# EAGLE design PowerMeterCurrent (EAGLE 7.3.0)
DATABASE: ../../../../digikeydb.txt
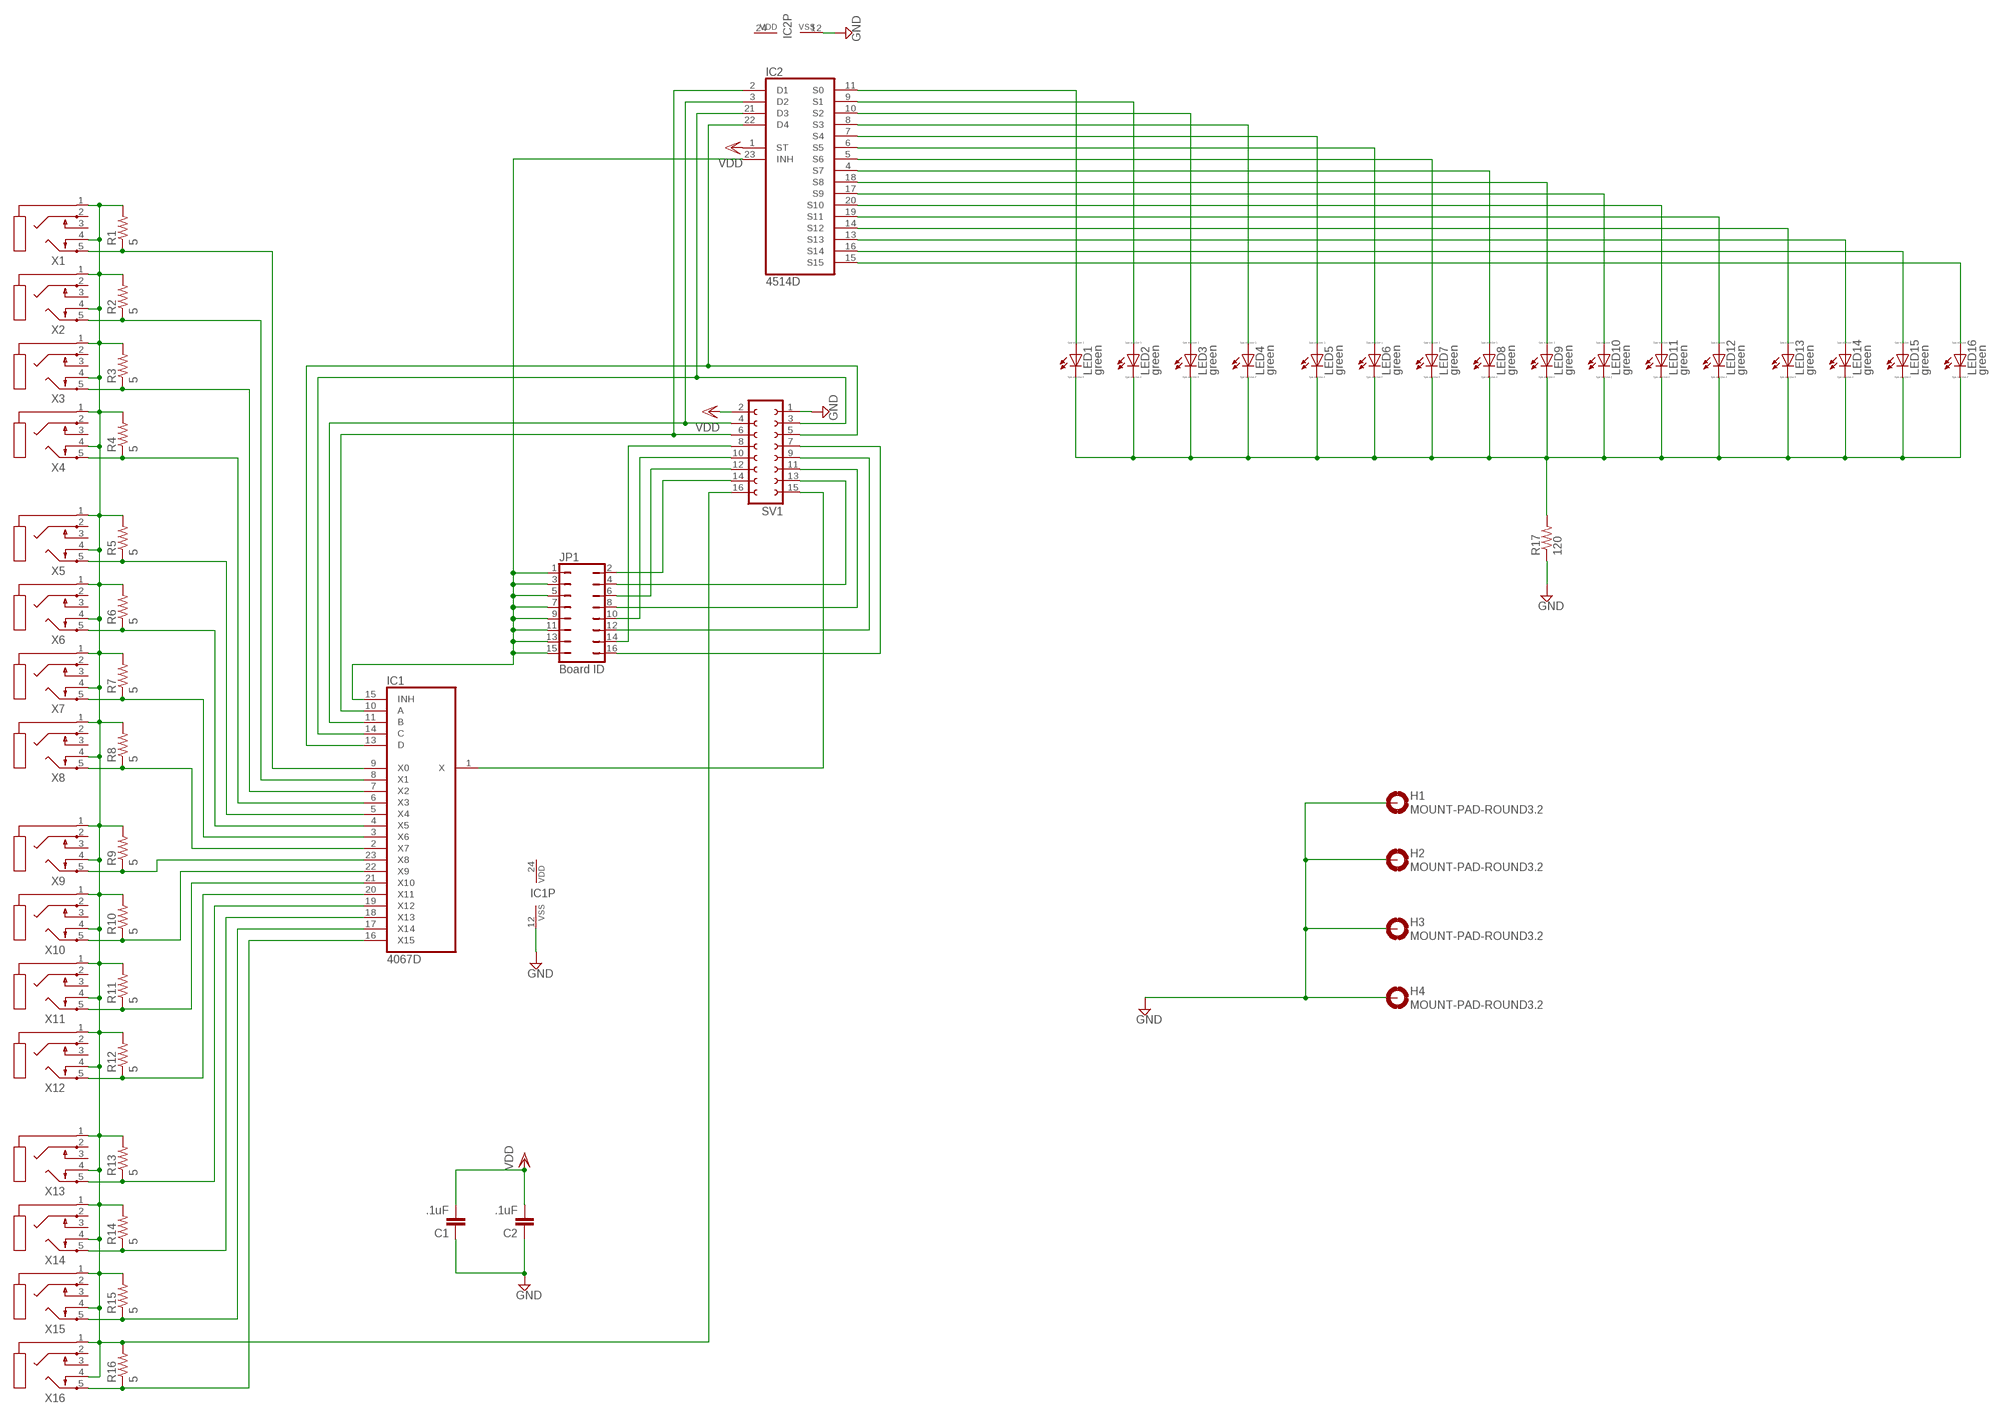
[diagram p0: schematic, sheet 1]

## Parts
C1  .1uF  C-EUC1206  [C1206]
C2  .1uF  C-EUC1206  [C1206]
H1  MOUNT-PAD-ROUND3.2  [3,2-PAD]
H2  MOUNT-PAD-ROUND3.2  [3,2-PAD]
H3  MOUNT-PAD-ROUND3.2  [3,2-PAD]
H4  MOUNT-PAD-ROUND3.2  [3,2-PAD]
IC1  4067D  [SO24W]
IC2  4514D  [SO24W]
JP1  Board ID  JP8Q  [JP8Q]
LED1  green  LED_E  [LED_1206]
LED2  green  LED_E  [LED_1206]
LED3  green  LED_E  [LED_1206]
LED4  green  LED_E  [LED_1206]
LED5  green  LED_E  [LED_1206]
LED6  green  LED_E  [LED_1206]
LED7  green  LED_E  [LED_1206]
LED8  green  LED_E  [LED_1206]
LED9  green  LED_E  [LED_1206]
LED10  green  LED_E  [LED_1206]
LED11  green  LED_E  [LED_1206]
LED12  green  LED_E  [LED_1206]
LED13  green  LED_E  [LED_1206]
LED14  green  LED_E  [LED_1206]
LED15  green  LED_E  [LED_1206]
LED16  green  LED_E  [LED_1206]
R1  5  R-US_R1206  [R1206]
R2  5  R-US_R1206  [R1206]
R3  5  R-US_R1206  [R1206]
R4  5  R-US_R1206  [R1206]
R5  5  R-US_R1206  [R1206]
R6  5  R-US_R1206  [R1206]
R7  5  R-US_R1206  [R1206]
R8  5  R-US_R1206  [R1206]
R9  5  R-US_R1206  [R1206]
R10  5  R-US_R1206  [R1206]
R11  5  R-US_R1206  [R1206]
R12  5  R-US_R1206  [R1206]
R13  5  R-US_R1206  [R1206]
R14  5  R-US_R1206  [R1206]
R15  5  R-US_R1206  [R1206]
R16  5  R-US_R1206  [R1206]
R17  120  R-US_R1206  [R1206]
SV1  FE08-2  [FE08-2]
X1  STEREOJACK  [STX3100]
X2  STEREOJACK  [STX3100]
X3  STEREOJACK  [STX3100]
X4  STEREOJACK  [STX3100]
X5  STEREOJACK  [STX3100]
X6  STEREOJACK  [STX3100]
X7  STEREOJACK  [STX3100]
X8  STEREOJACK  [STX3100]
X9  STEREOJACK  [STX3100]
X10  STEREOJACK  [STX3100]
X11  STEREOJACK  [STX3100]
X12  STEREOJACK  [STX3100]
X13  STEREOJACK  [STX3100]
X14  STEREOJACK  [STX3100]
X15  STEREOJACK  [STX3100]
X16  STEREOJACK  [STX3100]

## Nets
GND: C1.1 C2.1 H1.B3,2(MOUNT) H2.B3,2(MOUNT) H3.B3,2(MOUNT) H4.B3,2(MOUNT) IC1.12(VSS) IC2.12(VSS) R17.1 SV1.1
N$1: IC1.10(A) IC2.2(D1) SV1.6
N$2: IC2.15(S15) LED16.A
N$3: IC1.11(B) IC2.3(D2) SV1.4
N$4: IC1.14(C) IC2.21(D3) SV1.3
N$5: IC1.13(D) IC2.22(D4) SV1.5
N$6: IC1.15(INH) IC2.23(INH) JP1.1 JP1.3 JP1.5 JP1.7 JP1.9 JP1.11 JP1.13 JP1.15
N$7: JP1.14 SV1.8
N$8: JP1.10 SV1.10
N$9: IC2.16(S14) LED15.A
N$10: JP1.6 SV1.12
N$11: JP1.2 SV1.14
N$12: R1.2 R2.2 R3.2 R4.2 R5.2 R6.2 R7.2 R8.2 R9.2 R10.2 R11.2 R12.2 R13.2 R14.2 R15.2 R16.2 SV1.16 X1.1 X1.4 X2.1 X2.4 X3.1 X3.4 X4.1 X4.4 X5.1 X5.4 X6.1 X6.4 X7.1 X7.4 X8.1 X8.4 X9.1 X9.4 X10.1 X10.4 X11.1 X11.4 X12.1 X12.4 X13.1 X13.4 X14.1 X14.4 X15.1 X15.4 X16.1 X16.4
N$13: JP1.4 SV1.13
N$14: JP1.8 SV1.11
N$15: JP1.12 SV1.9
N$16: JP1.16 SV1.7
N$17: IC1.1(X) SV1.15
N$18: IC1.5(X4) R5.1 X5.5
N$19: IC2.13(S13) LED14.A
N$20: IC1.9(X0) R1.1 X1.5
N$21: LED1.C LED2.C LED3.C LED4.C LED5.C LED6.C LED7.C LED8.C LED9.C LED10.C LED11.C LED12.C LED13.C LED14.C LED15.C LED16.C R17.2
N$22: IC1.8(X1) R2.1 X2.5
N$23: IC1.7(X2) R3.1 X3.5
N$24: IC1.6(X3) R4.1 X4.5
N$25: IC1.4(X5) R6.1 X6.5
N$26: IC1.3(X6) R7.1 X7.5
N$28: IC1.2(X7) R8.1 X8.5
N$29: IC1.23(X8) R9.1 X9.5
N$30: IC2.14(S12) LED13.A
N$32: IC2.19(S11) LED12.A
N$34: IC2.20(S10) LED11.A
N$36: IC2.17(S9) LED10.A
N$38: IC2.18(S8) LED9.A
N$40: IC2.4(S7) LED8.A
N$42: IC2.5(S6) LED7.A
N$44: IC2.6(S5) LED6.A
N$46: IC2.7(S4) LED5.A
N$48: IC2.8(S3) LED4.A
N$50: IC1.22(X9) R10.1 X10.5
N$51: IC1.21(X10) R11.1 X11.5
N$52: IC2.10(S2) LED3.A
N$54: IC2.9(S1) LED2.A
N$56: IC2.11(S0) LED1.A
N$58: IC1.20(X11) R12.1 X12.5
N$59: IC1.18(X13) R14.1 X14.5
N$60: IC1.17(X14) R15.1 X15.5
N$66: IC1.19(X12) R13.1 X13.5
N$68: IC1.16(X15) R16.1 X16.5
VDD: C1.2 C2.2 IC2.1(ST) SV1.2
Unconnected: X1.2 X1.3 X2.2 X2.3 X3.2 X3.3 X4.2 X4.3 X5.2 X5.3 X6.2 X6.3 X7.2 X7.3 X8.2 X8.3 X9.2 X9.3 X10.2 X10.3 X11.2 X11.3 X12.2 X12.3 X13.2 X13.3 X14.2 X14.3 X15.2 X15.3 X16.2 X16.3

## Power pins joined to a net without a drawn wire
VDD: IC1.24(VDD) IC2.24(VDD)

## Library data of the parts
C1 C2 = rcl:C-EU: CAPACITOR, European symbol; PARTNO: C1206C104K5RAC7867
H1-H4 = holes:MOUNT-PAD-ROUND: MOUNTING PAD, round
IC1 = 40xx:4067: 16-channel ANALOG MULTIPLEXER; PARTNO: 74HC4067D,652
IC2 = 45xx:4514: 4-bit latch 4-16 line DECODER; PARTNO: 74HC154D,652
JP1 = jumper:JP8Q: JUMPER; PARTNO: 67996-416HLF
LED1-LED16 = eagle-ltspice:LED_E: LED Source: http://www.osram.convergy.de Source: www.luxeon.com Source: www.kingbright.com; PARTNO: LTST-C150GKT; SPICEMODEL: NONE; SPICEPREFIX: D; SPICETYPE: diode
R1-R16 = resistor:R-US_: RESISTOR, American symbol; PARTNO: RC1206FR-075R1L
R17 = resistor:R-US_: RESISTOR, American symbol; PARTNO: RC1206FR-07120RL
SV1 = con-lsta:FE08-2: FEMALE HEADER; OC_FARNELL: unknown; OC_NEWARK: unknown; PARTNO: SSQ-108-02-T-D
X1-X16 = adafruit:STEREOJACK: MIC/HEADPHONE JACK Stereo jack with two switches. Kycon STX3100, CUI SJ1-3555NG and/or 4UCon 05544; PARTNO: SJ1-3525N

## Board
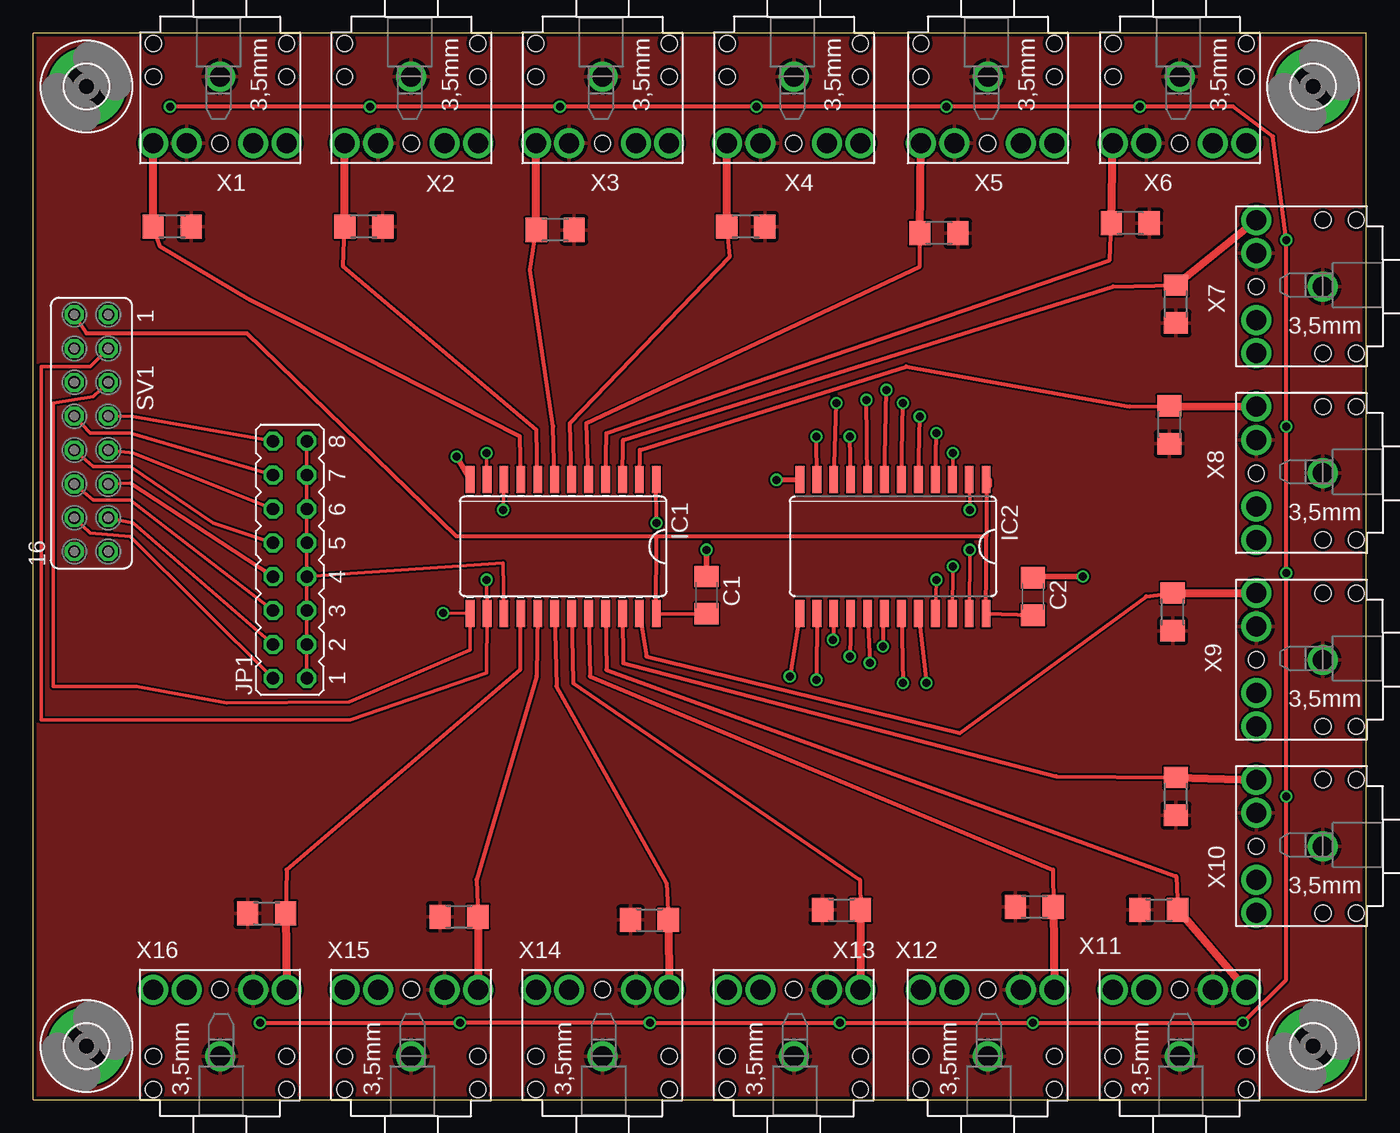
[diagram p1: board, top side]
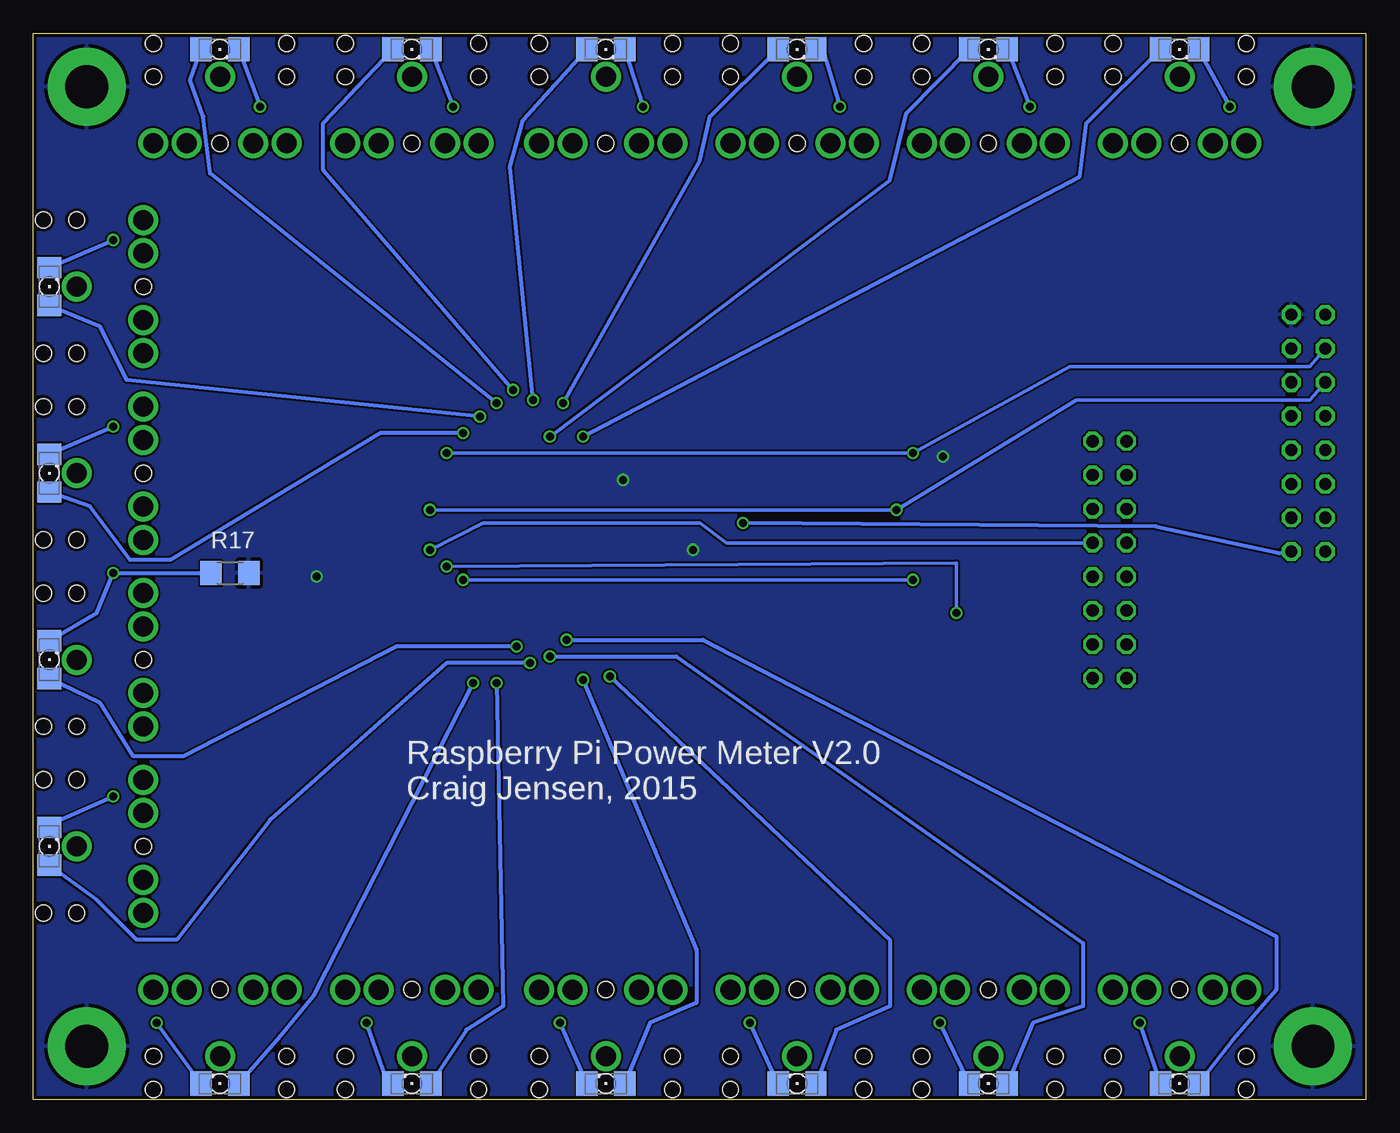
[diagram p2: board, bottom side, seen from below]

Size 100 x 80 mm. Coordinates in mm from the lower left corner, seen from the top.
Outline: 0,0 100,0 100,80 0,80 0,0
Copper layers (1*16): Top 0.035mm / dielectric 1.5mm / Bottom 0.035mm
Design rules "Elecrow_2-layer_eagle_rule": minimum track width 6mil, minimum drill 12mil, track to track 6mil, track to pad 6mil, pad to pad 6mil, via to via 6mil, smd to smd 0mil, copper to edge 10mil, drill to drill 10mil, minimum pad ring 10mil, minimum via ring 6mil, stop-mask expansion 2mil, vias tented up to drill 100mil, thermal gap 10mil

### Footprints (pad centres in the part's own frame; a part is rotated, then mirrored left to right if it is on the bottom)
C1206 = smd 1.6 x 1.8: 1 -1.4,0; 2 1.4,0
3,2-PAD = drill 3.2 pad 5.842: B3,2 0,0
SO24W = smd 0.66 x 2.032: 1 -6.985,-5.029; 2 -5.715,-5.029; 3 -4.445,-5.029; 4 -3.175,-5.029; 5 -1.905,-5.029; 6 -0.635,-5.029; 7 0.635,-5.029; 8 1.905,-5.029; 9 3.175,-5.029; 10 4.445,-5.029; 11 5.715,-5.029; 12 6.985,-5.029; 13 6.985,5.029; 14 5.715,5.029; 15 4.445,5.029; 16 3.175,5.029; 17 1.905,5.029; 18 0.635,5.029; 19 -0.635,5.029; 20 -1.905,5.029; 21 -3.175,5.029; 22 -4.445,5.029; 23 -5.715,5.029; 24 -6.985,5.029
JP8Q = drill 0.914 octagon: 1 -8.89,-1.27; 2 -8.89,1.27; 3 -6.35,-1.27; 4 -6.35,1.27; 5 -3.81,-1.27; 6 -3.81,1.27; 7 -1.27,-1.27; 8 -1.27,1.27; 9 1.27,-1.27; 10 1.27,1.27; 11 3.81,-1.27; 12 3.81,1.27; 13 6.35,-1.27; 14 6.35,1.27; 15 8.89,-1.27; 16 8.89,1.27
LED_1206 = smd 1.6 x 1.803: A -1.422,0; C 1.422,0
R1206 = smd 1.6 x 1.803: 1 -1.422,0; 2 1.422,0
FE08-2 = drill 0.914 octagon: 1 -8.89,1.27; 2 -8.89,-1.27; 3 -6.35,1.27; 4 -6.35,-1.27; 5 -3.81,1.27; 6 -3.81,-1.27; 7 -1.27,1.27; 8 -1.27,-1.27; 9 1.27,1.27; 10 1.27,-1.27; 11 3.81,1.27; 12 3.81,-1.27; 13 6.35,1.27; 14 6.35,-1.27; 15 8.89,1.27; 16 8.89,-1.27
STX3100 = drill 1.5: 1 4.5,0; 2 9.5,5; 3 9.5,2.5; 4 9.5,-2.5; 5 9.5,-5 | hole 1.2: 2,5; 4.5,5; 4.5,-5; 9.5,0; 2,-5

### Placement (x,y rotation side)
C1  50.52,37.84 270 top
C2  75,37.75 270 top
H1  4,76 0 top
H2  96,76 0 top
H3  96,4 0 top
H4  4,4 0 top
IC1  39.75,41.5 180 top
IC2  64.5,41.5 180 top
JP1  19.25,40.5 90 top
LED1  14,78.8 0 bottom
LED2  28.35,78.8 0 bottom
LED3  42.7,78.8 0 bottom
LED4  57.05,78.8 0 bottom
LED5  71.6,78.8 0 bottom
LED6  86,78.8 0 bottom
LED7  98.8,61 90 bottom
LED8  98.8,47 90 bottom
LED9  98.8,33 90 bottom
LED10  98.8,19 90 bottom
LED11  86,1.2 180 bottom
LED12  71.6,1.2 180 bottom
LED13  57.05,1.2 180 bottom
LED14  42.7,1.2 180 bottom
LED15  28.35,1.2 180 bottom
LED16  14,1.2 180 bottom
R1  10.42,65.49 0 top
R2  24.79,65.5 0 top
R3  39.15,65.25 0 top
R4  53.45,65.5 0 top
R5  67.94,65 0 top
R6  82.3,65.75 0 top
R7  85.72,59.69 270 top
R8  85.22,50.62 270 top
R9  85.47,36.59 270 top
R10  85.72,22.75 270 top
R11  84.44,14.22 180 top
R12  75.1,14.47 180 top
R13  60.64,14.22 180 top
R14  46.23,13.47 180 top
R15  31.94,13.72 180 top
R16  17.5,13.97 180 top
R17  85.25,39.5 180 bottom
SV1  4.35,50 270 top
X1  14,81.25 270 top
X2  28.35,81.25 270 top
X3  42.7,81.25 270 top
X4  57.05,81.25 270 top
X5  71.6,81.25 270 top
X6  86,81.25 270 top
X7  101.25,61 180 top
X8  101.25,47 180 top
X9  101.25,33 180 top
X10  101.25,19 180 top
X11  86,-1.25 90 top
X12  71.6,-1.25 90 top
X13  57.05,-1.25 90 top
X14  42.7,-1.25 90 top
X15  28.35,-1.25 90 top
X16  14,-1.25 90 top

### Tracks (layer width: path | path; a pad name or v marks a point on that pad's centre or on a via)
GND  (via drill 0.6)
  Top 0.406: C2.1 75.1,39.25 v78.75,39.25 | IC1.12 v31.75,48.25 | C1.1 v50.5,41.25 | IC2.12 v55.75,46.5
  pour Bottom: -1,81 102,80.75 102,-3.25 -1.25,-3 -1.25,81
N$1  (via drill 0.6)
  Top 0.254: v35.25,44.25 IC1.10 | IC2.2 v70.25,44.25
  Bottom 0.254: v70.25,44.25 v35.25,44.25 21.75,52.5 4.25,52.5 SV1.6
N$2  (via drill 0.6)
  Top 0.305: IC2.15 v60,34.5
  Bottom 0.305: v60,34.5 49.75,34.5 6.75,12.25 6.75,8.25 10,4.5 LED16.A
N$3  (via drill 0.6)
  Top 0.254: v34,48.5 IC1.11 | IC2.3 v69,48.5
  Bottom 0.254: v69,48.5 v34,48.5 22.25,55 4.25,55 SV1.4
N$4  (via drill 0.6)
  Top 0.254: IC2.21 v67.75,39 | v34,39 IC1.14 34,32 23.75,28.5 0.6,28.5 0.6,55 4.25,55 4.75,55.5 SV1.3
  Bottom 0.254: v67.75,39 v34,39
N$5  (via drill 0.6)
  Top 0.254: IC2.22 v69,40 | v30.75,36.5 IC1.13 32.75,33.75 23.71,29.84 14.5,29.75 7.75,31 1.5,31 1.5,52.25 4.5,52.75 SV1.5
  Bottom 0.254: v69,40 30.75,40.25 v30.75,36.5
N$6  (via drill 0.6)
  Top 0.254: JP1.15 JP1.13 JP1.11 JP1.9 20.5,41.5 JP1.7 | JP1.7 20.5,39.25 JP1.5 JP1.3 20.5,34.25 JP1.1 | IC1.15 35.25,40.25 JP1.7 | IC2.23 v70.25,41.25
  Bottom 0.254: JP1.9 48,41.75 50,43.25 66.25,43.25 v70.25,41.25
N$7
  Top 0.254: JP1.14 7.25,50 4.25,50 SV1.8
N$8
  Top 0.254: JP1.10 13.5,43.25 7.25,47.5 4.5,47.5 SV1.10
N$9  (via drill 0.6)
  Top 0.305: IC2.16 v61.25,33.25
  Bottom 0.305: v61.25,33.25 51.75,33.25 21.25,11.75 21.25,7 25,5.75 LED15.A
N$10
  Top 0.254: JP1.6 7.25,45 4.5,45 SV1.12
N$11
  Top 0.254: JP1.2 7.25,42.25 4.25,42.5 SV1.14
N$12
  pour Top: -2,81.75 104,81.75 104,-4.25 -2.25,-4.25 -2,31 -2,65.75
N$13
  Top 0.254: JP1.4 7.5,43.25 SV1.13
N$14
  Top 0.254: JP1.8 7.25,46.25 SV1.11
N$15
  Top 0.254: JP1.12 7.5,48.5 SV1.9
N$16
  Top 0.254: JP1.16 7.5,51.25 SV1.7
N$17  (via drill 0.6)
  Top 0.305: v46.75,43.25 IC1.1
  Bottom 0.254: 6.5,41 SV1.15
  Bottom 0.305: v46.75,43.25 15.75,43 6.5,41
N$18
  Top 0.305: IC1.5 41.5,50.75 66.5,62.5 R5.1
  Top 0.61: R5.1 X5.5
N$19  (via drill 0.6)
  Top 0.305: IC2.13 v56.75,31.75
  Bottom 0.305: v56.75,31.75 35.75,12 35.75,7 39.75,5.25 LED14.A
N$20
  Top 0.305: IC1.9 36.5,49.75 22.25,57 16.25,60 9.5,64 R1.1
  Top 0.61: R1.1 X1.5
N$21  (via drill 0.6)
  Top 0.305: v10.25,74.5 v25.25,74.5 v39.5,74.5 v54.25,74.5 v68.5,74.5 v83,74.5 90,74.5 93,72.25 v94,64.5 v94,50.5 v94,39.5 v94,22.75 94,9 v90.75,5.75 v75,5.75 v60.5,5.75 v46.25,5.75 v32,5.75 v17,5.75
  Bottom 0.305: LED14.C v46.25,5.75 | LED13.C v60.5,5.75 | LED12.C 73.5,1.5 v75,5.75 | LED11.C v90.75,5.75 | LED10.C 98.5,20.75 v94,22.75 | LED8.C v94,50.5 | LED7.C v94,64.5 | LED6.C v83,74.5 | LED5.C v68.5,74.5 | LED4.C v54.25,74.5 | LED3.C 40.75,78.75 v39.5,74.5 | LED2.C v25.25,74.5 | LED15.C v32,5.75 | LED1.C v10.25,74.5 | LED16.C v17,5.75 | LED9.C 95.25,36.5 v94,39.5 R17.2
N$22
  Top 0.305: IC1.8 37.75,50.25 23.25,62.5 R2.1
  Top 0.61: R2.1 X2.5
N$23
  Top 0.305: IC1.7 39,50.5 37.25,62.25 R3.1
  Top 0.61: R3.1 X3.5
N$24
  Top 0.305: IC1.6 40.25,50.75 52.25,63.25 R4.1
  Top 0.61: R4.1 X4.5
N$25
  Top 0.305: IC1.4 43,50 80.75,63 R6.1
  Top 0.61: R6.1 X6.5
N$26
  Top 0.305: IC1.3 44.25,49.5 81,61 R7.1
  Top 0.61: R7.1 X7.5
N$28
  Top 0.305: IC1.2 45.5,48.75 65.5,55 82.25,52 R8.1
  Top 0.61: R8.1 X8.5
N$29
  Top 0.305: IC1.23 46,33.25 69.5,27.5 83.5,37.75 R9.1
  Top 0.61: R9.1 X9.5
N$30  (via drill 0.6)
  Top 0.305: IC2.14 v58.75,31.5
  Bottom 0.305: v58.75,31.5 50.25,11.25 50.25,7.25 53.75,5.75 LED13.A
N$32  (via drill 0.6)
  Top 0.305: IC2.19 v65.25,31.25
  Bottom 0.305: v65.25,31.25 64.75,7 67.5,5.25 LED12.A
N$34  (via drill 0.6)
  Top 0.305: IC2.20 v67,31.25
  Bottom 0.305: v67,31.25 79,7.75 81.5,4.75 LED11.A
N$36  (via drill 0.6)
  Top 0.305: IC2.17 v62.75,32.75
  Bottom 0.305: v62.75,32.75 69,32.75 82.25,21 89.25,12 92.25,12 95.25,15 LED10.A
N$38  (via drill 0.6)
  Top 0.305: IC2.18 63.75,36.25 v63.75,34
  Bottom 0.305: v63.75,34 72.75,34 88.75,25.75 92.5,25.75 95,29.75 LED9.A
N$40  (via drill 0.6)
  Top 0.305: IC2.4 v67.75,50
  Bottom 0.305: v67.75,50 74,50 89.75,40.5 92.75,40.5 95.75,44.5 LED8.A
N$42  (via drill 0.6)
  Top 0.305: IC2.5 v66.5,51.25
  Bottom 0.305: v66.5,51.25 93,54 95,58 LED7.A
N$44  (via drill 0.6)
  Top 0.305: IC2.6 v65.25,52.25
  Bottom 0.305: v65.25,52.25 86.75,69.5 87.25,73.75 88.25,76.5 LED6.A
N$46  (via drill 0.6)
  Top 0.305: IC2.7 v64,53.25
  Bottom 0.305: v64,53.25 78.25,69.75 78.25,73.25 LED5.A
N$48  (via drill 0.6)
  Top 0.305: IC2.8 v62.5,52.5
  Bottom 0.305: v62.5,52.5 64.25,70 63.25,73.5 LED4.A
N$50
  Top 0.305: IC1.22 44.25,32.75 76.75,24.25 R10.1
  Top 0.61: R10.1 X10.5
N$51
  Top 0.305: IC1.21 43,32.25 85.75,16.75 R11.1
  Top 0.61: R11.1 X11.5
N$52  (via drill 0.6)
  Top 0.305: IC2.10 v60.25,52.25
  Bottom 0.305: v60.25,52.25 50,70.5 49.25,73.75 LED3.A
N$54  (via drill 0.6)
  Top 0.305: IC2.9 v61.25,49.75
  Bottom 0.305: v61.25,49.75 35.75,69 34.5,74 LED2.A
N$56  (via drill 0.6)
  Top 0.305: IC2.11 v58.75,49.75
  Bottom 0.305: v58.75,49.75 21.5,69.25 21,73.25 LED1.A
N$58
  Top 0.305: IC1.20 41.75,31.75 76.5,17.25 R12.1
  Top 0.61: R12.1 X12.5
N$59
  Top 0.305: IC1.18 39.25,31 47.5,16.25 R14.1
  Top 0.61: R14.1 X14.5
N$60
  Top 0.305: IC1.17 37.75,31.75 33.25,16.5 R15.1
  Top 0.61: R15.1 X15.5
N$66
  Top 0.305: IC1.19 40.5,31.25 62,16.5 R13.1
  Top 0.61: R13.1 X13.5
N$68
  Top 0.305: IC1.16 36.5,36.47 36.5,32.25 19,17.25 R16.1
  Top 0.61: R16.1 X16.5
VDD
  Top 0.305: C1.2 IC1.24 46.75,42.25 | 71.5,42.25 71.49,40 IC2.24 C2.2 | 71.5,42.25 46.75,42.25 | 46.75,42.25 31.75,42.25 16,57.5 4,57.5 SV1.2 | IC2.1 71.75,46.53 71.75,46 71.5,46 71.5,42.25

### Text on the board
bPlace: Raspberry Pi Power Meter V2.0 / Craig Jensen, 2015